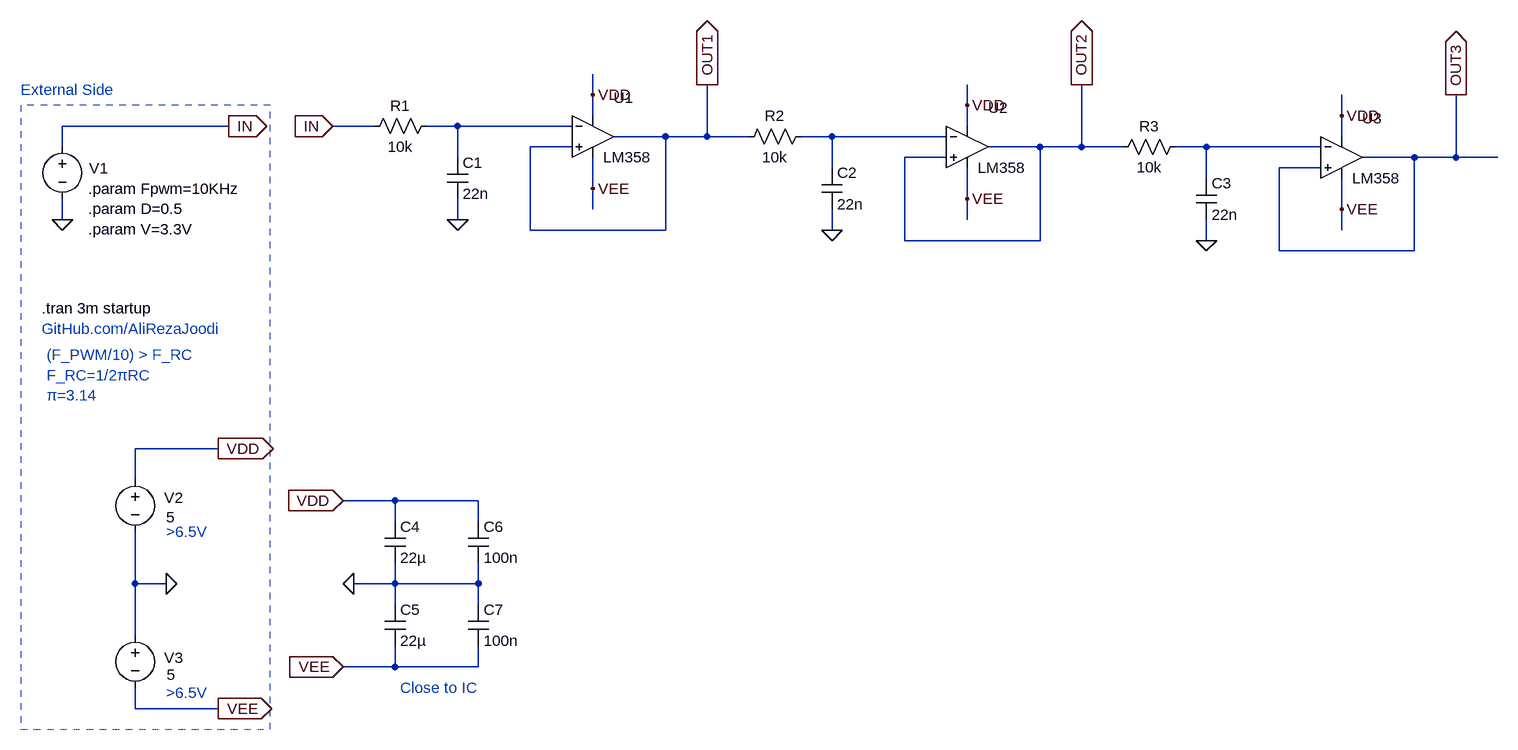
[diagram p0: schematic v1.0.asc]
v1.0.asc, the LTspice schematic file:
Version 4.1
SHEET 1 1352 1064
WIRE -48 48 -48 16
WIRE 528 64 528 32
WIRE -48 80 -48 48
WIRE 1104 80 1104 48
WIRE -608 96 -864 96
WIRE -384 96 -448 96
WIRE -256 96 -304 96
WIRE -80 96 -256 96
WIRE 528 96 528 64
WIRE 64 112 -16 112
WIRE 128 112 128 32
WIRE 128 112 64 112
WIRE 192 112 128 112
WIRE 320 112 272 112
WIRE 496 112 320 112
WIRE 1104 112 1104 80
WIRE -864 128 -864 96
WIRE -80 128 -144 128
WIRE 640 128 560 128
WIRE 704 128 704 32
WIRE 704 128 640 128
WIRE 768 128 704 128
WIRE 896 128 848 128
WIRE 1072 128 896 128
WIRE -256 144 -256 96
WIRE 496 144 432 144
WIRE 1216 144 1136 144
WIRE 1280 144 1280 48
WIRE 1280 144 1216 144
WIRE 1344 144 1280 144
WIRE 320 160 320 112
WIRE 1072 160 1008 160
WIRE 896 176 896 128
WIRE -48 192 -48 144
WIRE 528 208 528 160
WIRE -48 224 -48 192
WIRE 1104 224 1104 176
WIRE -864 240 -864 208
WIRE -256 240 -256 208
WIRE 528 240 528 208
WIRE -144 256 -144 128
WIRE 64 256 64 112
WIRE 64 256 -144 256
WIRE 320 256 320 224
WIRE 1104 256 1104 224
WIRE 432 272 432 144
WIRE 640 272 640 128
WIRE 640 272 432 272
WIRE 896 272 896 240
WIRE 1008 288 1008 160
WIRE 1216 288 1216 144
WIRE 1216 288 1008 288
WIRE -624 592 -752 592
WIRE -752 640 -752 592
WIRE -352 672 -432 672
WIRE -224 672 -352 672
WIRE -352 704 -352 672
WIRE -224 704 -224 672
WIRE -752 800 -752 720
WIRE -704 800 -752 800
WIRE -352 800 -352 768
WIRE -352 800 -416 800
WIRE -224 800 -224 768
WIRE -224 800 -352 800
WIRE -352 832 -352 800
WIRE -224 832 -224 800
WIRE -752 880 -752 800
WIRE -352 928 -352 896
WIRE -352 928 -432 928
WIRE -224 928 -224 896
WIRE -224 928 -352 928
WIRE -752 992 -752 960
WIRE -624 992 -752 992
FLAG -256 240 0
FLAG 704 32 OUT2
IOPIN 704 32 Out
FLAG 528 64 VDD
FLAG -48 48 VDD
FLAG 528 208 VEE
FLAG -48 192 VEE
FLAG 320 256 0
FLAG 128 32 OUT1
IOPIN 128 32 Out
FLAG -448 96 IN
IOPIN -448 96 In
FLAG 1280 48 OUT3
IOPIN 1280 48 Out
FLAG 1104 80 VDD
FLAG 1104 224 VEE
FLAG 896 272 0
FLAG -864 240 0
FLAG -608 96 IN
IOPIN -608 96 Out
FLAG -624 992 VEE
IOPIN -624 992 Out
FLAG -704 800 0
FLAG -624 592 VDD
IOPIN -624 592 Out
FLAG -416 800 0
FLAG -432 672 VDD
IOPIN -432 672 In
FLAG -432 928 VEE
IOPIN -432 928 In
SYMBOL res -288 80 R90
WINDOW 0 0 56 VBottom 2
WINDOW 3 32 56 VTop 2
SYMATTR InstName R1
SYMATTR Value 10k
SYMBOL cap -272 144 R0
SYMATTR InstName C1
SYMATTR Value 22n
SYMBOL MyLib\\OpAmp\\LM358 528 64 R0
WINDOW 0 32 4 Left 2
WINDOW 38 35 31 Left 2
SYMATTR InstName U2
SYMBOL MyLib\\OpAmp\\LM358 -48 48 R0
WINDOW 0 32 4 Left 2
WINDOW 38 35 31 Left 2
SYMATTR InstName U1
SYMBOL res 288 96 R90
WINDOW 0 0 56 VBottom 2
WINDOW 3 32 56 VTop 2
SYMATTR InstName R2
SYMATTR Value 10k
SYMBOL cap 304 160 R0
SYMATTR InstName C2
SYMATTR Value 22n
SYMBOL MyLib\\OpAmp\\LM358 1104 80 R0
WINDOW 0 32 4 Left 2
WINDOW 38 35 31 Left 2
SYMATTR InstName U3
SYMBOL res 864 112 R90
WINDOW 0 0 56 VBottom 2
WINDOW 3 32 56 VTop 2
SYMATTR InstName R3
SYMATTR Value 10k
SYMBOL cap 880 176 R0
SYMATTR InstName C3
SYMATTR Value 22n
SYMBOL voltage -864 112 R0
WINDOW 0 41 49 Left 2
WINDOW 3 -51 -74 Invisible 2
WINDOW 123 0 0 Left 0
WINDOW 39 0 0 Left 0
SYMATTR InstName V1
SYMATTR Value PULSE(0 {V} 0 10n 10n {D/Fpwm} {1/Fpwm})
SYMBOL voltage -752 624 R0
WINDOW 0 74 44 Right 2
WINDOW 3 61 74 Right 2
WINDOW 123 0 0 Left 0
WINDOW 39 0 0 Left 0
SYMATTR InstName V2
SYMATTR Value 5
SYMBOL voltage -752 864 R0
WINDOW 0 74 50 Right 2
WINDOW 3 62 76 Right 2
WINDOW 123 0 0 Left 0
WINDOW 39 0 0 Left 0
SYMATTR InstName V3
SYMATTR Value 5
SYMBOL cap -368 704 R0
SYMATTR InstName C4
SYMATTR Value 22µ
SYMBOL cap -368 832 R0
SYMATTR InstName C5
SYMATTR Value 22µ
SYMBOL cap -240 704 R0
SYMATTR InstName C6
SYMATTR Value 100n
SYMBOL cap -240 832 R0
SYMATTR InstName C7
SYMATTR Value 100n
TEXT -888 448 Left 2 ;(F_PWM/10) > F_RC\nF_RC=1/2πRC\nπ=3.14
TEXT -824 192 Left 2 !.param Fpwm=10KHz\n.param D=0.5\n.param V=3.3V
TEXT -896 376 Left 2 !.tran 3m startup
TEXT -896 408 Left 2 ;GitHub.com/AliRezaJoodi
TEXT -928 40 Left 2 ;External Side
TEXT -704 720 Left 2 ;>6.5V
TEXT -704 968 Left 2 ;>6.5V
TEXT -344 960 Left 2 ;Close to IC
RECTANGLE Normal -928 1024 -544 64 2

The netlist it stands for:
* v1.0.asc
R1 N001 IN 10k
C1 N001 0 22n
* U2: LM358 (symbol MyLib\OpAmp\LM358 not available, pins judged from their places): In+=OUT2 In-=N002 V+=VDD V-=VEE OUT=OUT2
* U1: LM358 (symbol MyLib\OpAmp\LM358 not available, pins judged from their places): In+=OUT1 In-=N001 V+=VDD V-=VEE OUT=OUT1
R2 N002 OUT1 10k
C2 N002 0 22n
* U3: LM358 (symbol MyLib\OpAmp\LM358 not available, pins judged from their places): In+=OUT3 In-=N003 V+=VDD V-=VEE OUT=OUT3
R3 N003 OUT2 10k
C3 N003 0 22n
V1 IN 0 PULSE(0 {V} 0 10n 10n {D/Fpwm} {1/Fpwm})
V2 VDD 0 5
V3 0 VEE 5
C4 VDD 0 22µ
C5 0 VEE 22µ
C6 VDD 0 100n
C7 0 VEE 100n
* (F_PWM/10) > F_RC
* F_RC=1/2πRC
* π=3.14
.param Fpwm=10KHz
.param D=0.5
.param V=3.3V
.tran 3m startup
* GitHub.com/AliRezaJoodi
* External Side
* >6.5V
* >6.5V
* Close to IC
.backanno
.end